# EAGLE design SparkX_smol_Dynamic_NFC_RFID_Tag (EAGLE 9.6.2)
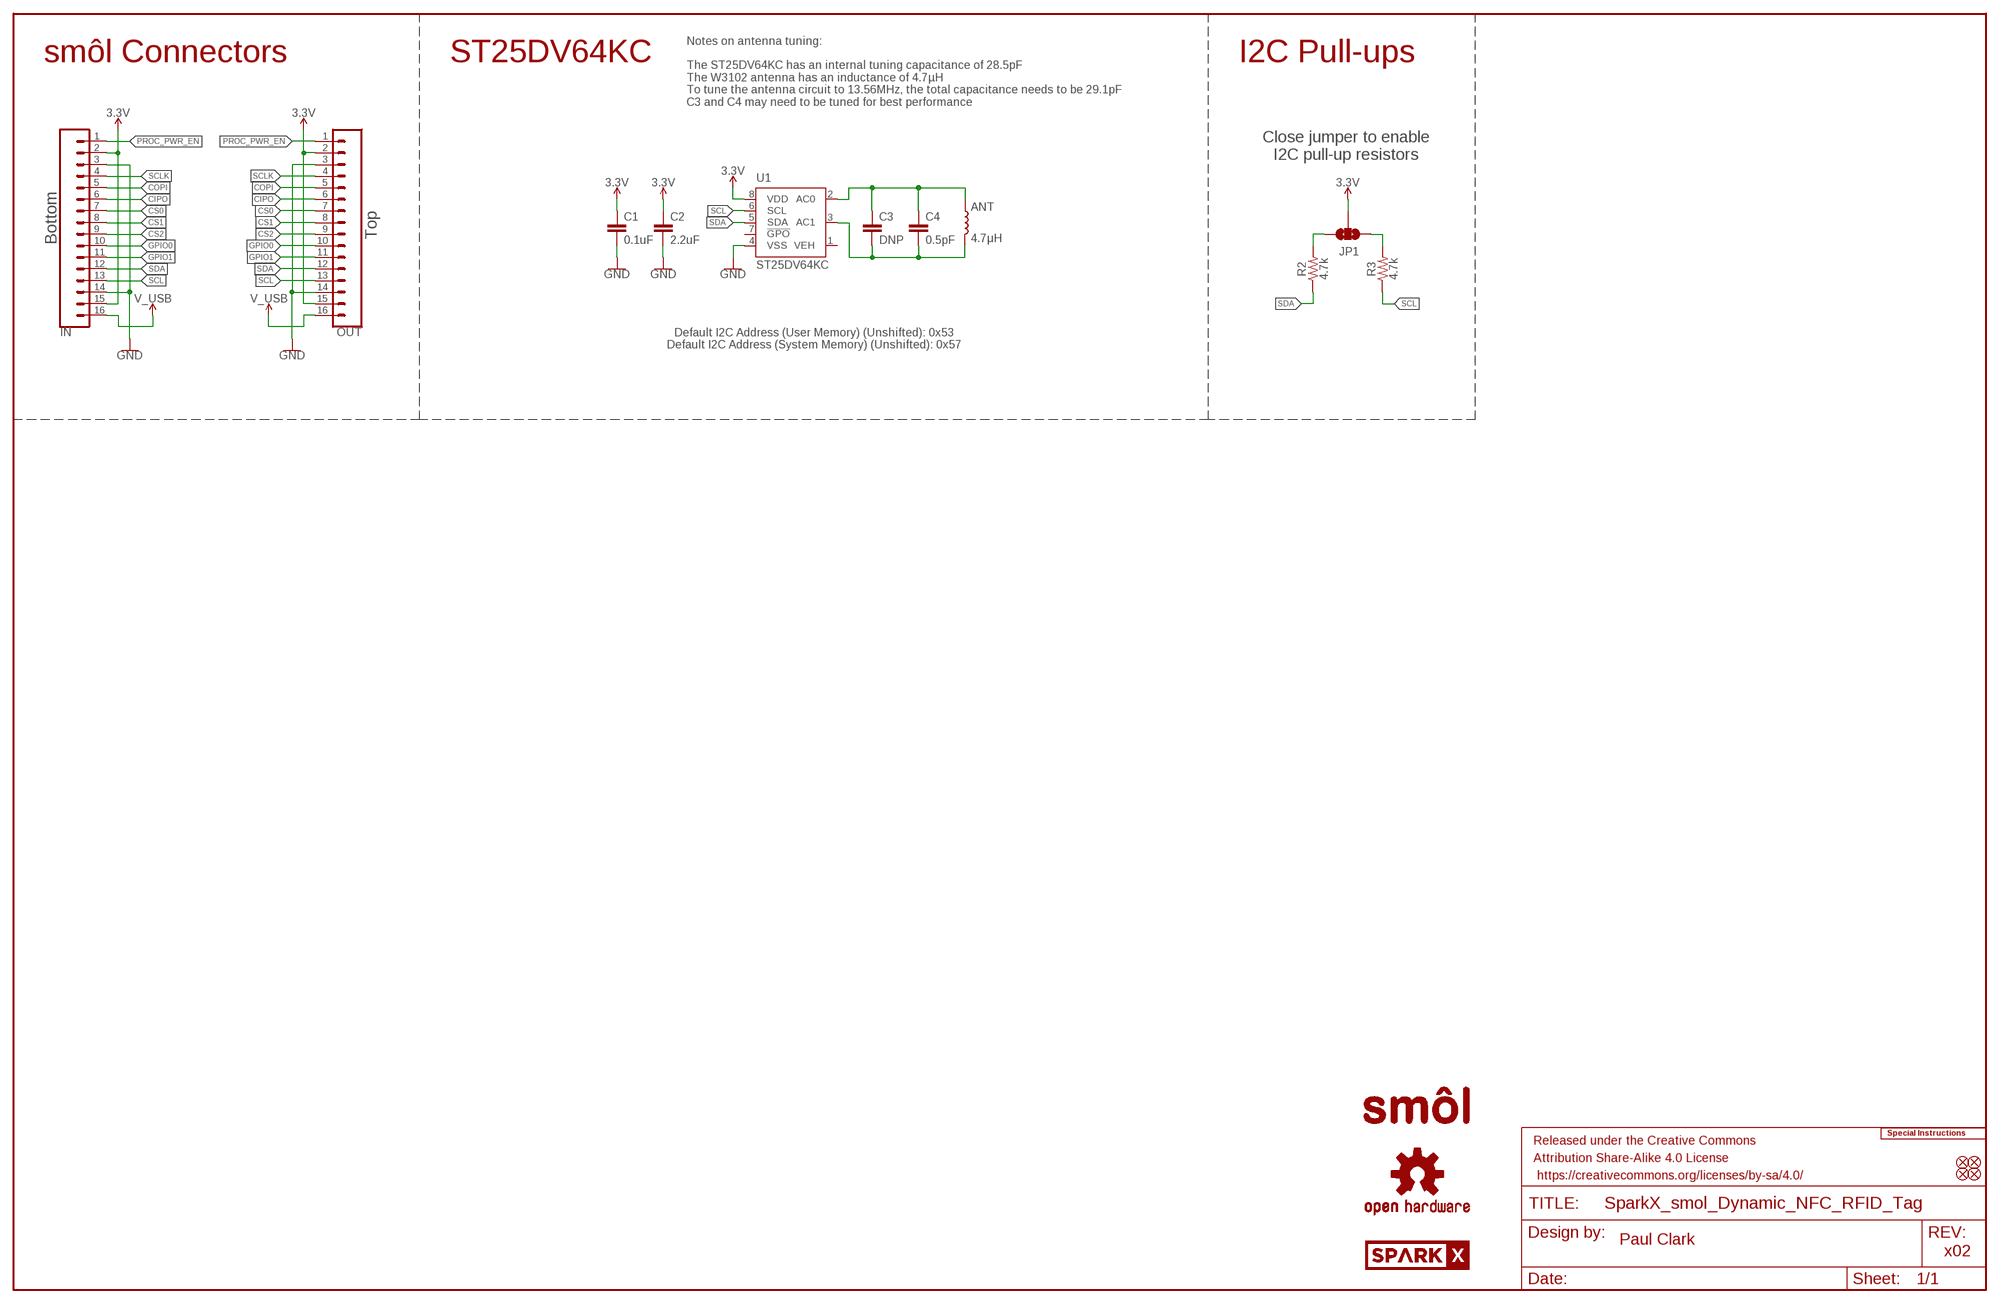
[diagram p0: schematic, sheet 1]

## Parts
ANT  4.7μH  RFID_ANTENNA_W3102  [W3102]
C1  0.1uF  0.1UF-0402T-6.3V-10%-X7R  [0402-TIGHT]
C2  2.2uF  2.2UF-0402_TIGHT-10V-10%-X5R  [0402-TIGHT]
C3  DNP  DNP-0402-TIGHT_NO_CREAM  [0402-TIGHT_NO_CREAM]
C4  0.5pF  0.5PF-0402_TIGHT-50V-PM0.05PF-NP0  [0402-TIGHT]
FD1  FIDUCIALUFIDUCIAL  [FIDUCIAL-MICRO]
FD2  FIDUCIALUFIDUCIAL  [FIDUCIAL-MICRO]
FD3  FIDUCIALUFIDUCIAL  [FIDUCIAL-MICRO]
FD4  FIDUCIALUFIDUCIAL  [FIDUCIAL-MICRO]
FRAME1  FRAME-LEDGER  [CREATIVE_COMMONS]
IN  CONN_16FPC_16_0.5MM  [FPC_16_0.5MM]
JP1  JUMPER-SMT_3_NO_SILK  [SMT-JUMPER_3_NO_SILK]
LOGO1  SPECIAL_INSTRUCTIONS-ORDERING  [ORDERING_INSTRUCTIONS]
LOGO2  OSHW-LOGOMINI  [OSHW-LOGO-MINI]
LOGO3  OSHW-LOGOMINI  [OSHW-LOGO-MINI]
OUT  CONN_16FPC_16_0.5MM  [FPC_16_0.5MM]
R2  4.7k  4.7KOHM-0402T-1/16W-1%  [0402-TIGHT]
R3  4.7k  4.7KOHM-0402T-1/16W-1%  [0402-TIGHT]
U1  ST25DV64KC  [SO08]
U$1  SPARKX-LOGO3  [SPARKX-SMALL]
U$3  SMOL_LOGOSMALL  [SMOL_SMALL]
U$9  SMOL_LOGOSMALL  [SMOL_SMALL]

## Nets
3.3V: C1.1 C2.1 IN.2 IN.15 JP1.2 OUT.2 OUT.15 U1.8(VDD)
CIPO: IN.6 OUT.6
COPI: IN.5 OUT.5
CS0: IN.7 OUT.7
CS1: IN.8 OUT.8
CS2: IN.9 OUT.9
GND: C1.2 C2.2 IN.3 IN.14 OUT.3 OUT.14 U1.4(VSS)
GPIO0: IN.10 OUT.10
GPIO1: IN.11 OUT.11
N$1: ANT.2 C3.2 C4.2 U1.3(AC1)
N$2: ANT.1 C3.1 C4.1 U1.2(AC0)
N$3: JP1.3 R2.2
N$4: JP1.1 R3.2
PROC_PWR_EN: IN.1 OUT.1
SCL: IN.13 OUT.13 R3.1 U1.6(SCL)
SCLK: IN.4 OUT.4
SDA: IN.12 OUT.12 R2.1 U1.5(SDA)
V_USB: IN.16 OUT.16
Unconnected: U1.7(!GPO!)

## Notes on the sheet
- Notes on antenna tuning:
  
  The ST25DV64KC has an internal tuning capacitance of 28.5pF
  The W3102 antenna has an inductance of 4.7µH
  To tune the antenna circuit to 13.56MHz, the total capacitance needs to be 29.1pF
  C3 and C4 may need to be tuned for best performance
- smôl Connectors | ST25DV64KC | I2C Pull-ups
- Close jumper to enable
  I2C pull-up resistors
- Top
- Bottom
- Default I2C Address (User Memory) (Unshifted): 0x53
  Default I2C Address (System Memory) (Unshifted): 0x57
- Paul Clark
- x02

## Power pins joined to a net without a drawn wire
VEH: U1.1(VEH)

## Library data of the parts
ANT = SparkFun-RF:RFID_ANTENNA_W3102: W3102 Pulse Larsen NFC / RFID SMD Antenna 13.56MHz 4.7μH; PROD_ID: ANT-16333
C1 = SparkFun-Capacitors:0.1UF: 0.1µF ceramic capacitors A capacitor is a passive two-terminal electrical component used to store electrical energy temporarily in an electric field.; PROD_ID: CAP-14993
C2 = SparkFun-Capacitors:2.2UF: 2.2µF ceramic capacitors A capacitor is a passive two-terminal electrical component used to store electrical energy temporarily in an electric field.; PROD_ID: CAP-14232
C3 = SparkFun-Capacitors:DNP: Do-Not-Populate capacitor
C4 = SparkFun-Capacitors:0.5PF: 0.5pF ceramic capacitors A capacitor is a passive two-terminal electrical component used to store electrical energy temporarily in an electric field.; PROD_ID: CAP-14362
FD1-FD4 = SparkFun-Aesthetics:FIDUCIAL: Fiducial Alignment Points Point-of-reference for pick-and-place machines and other optical instruments.
FRAME1 = SparkFun-Aesthetics:FRAME-LEDGER: Schematic Frame - Ledger Standard 11x14 US Ledger frame
IN OUT = SparkFun-Connectors:CONN_16: Multi connection point. Often used as Generic Header-pin footprint for 0.1 inch spaced/style header connections On any of the 0.1 inch spaced packages, you can populate with these: Break Away Headers - Straight <https://www.sparkfun.com/products/116> (PRT-00116) Break Away Male Headers - Right Angle <https://www.sparkfun.com/products/553> (PRT-00553) Female Headers <https://www.sparkfun.com/products/115> (PRT-00115) Break Away Headers - Machine Pin <https://www.sparkfun.com/products/117> (PRT-00117) Break Away Female Headers - Swiss Machine Pin <https://www.sparkfun.com/products/743> (PRT-00743) For SCREWTERMINALS and SPRING TERMINALS visit here: Screw Terimnals on SparkFun.com <https://www.sparkfun.com/search/results?term=Screw+Terminals> (5mm/3.5mm/2.54mm spacing) This device is also useful as a general connection point to wire up your design to another part of your project. Our various solder wires solder well into these plated through hole pads. Hook-Up Wire - Assortment (Stranded, 22 AWG) <https://www.sparkfun.com/products/11375> (PRT-11375) Hook-Up Wire - Assortment (Solid Core, 22 AWG) <https://www.sparkfun.com/products/11367> (PRT-11367) View the entire wire category on our website here <https://www.sparkfun.com/categories/141> Special notes: Molex polarized connector foot print use with SKU : PRT-08231 with associated crimp pins and housings. 1MM SMD Version SKU: PRT-10208 NOTES ON THE VARIANTS LOCK and LOCK_LONGPADS... This footprint was designed to help hold the alignment of a through-hole component (i.e. 6-pin header) while soldering it into place. You may notice that each hole has been shifted either up or down by 0.005 of an inch from it's more standard position (which is a perfectly straight line). This slight alteration caused the pins (the squares in the middle) to touch the edges of the holes. Because they are alternating, it causes a "brace" to hold the component in place. 0.005 has proven to be the perfect amount of "off-center" position when using our standard breakaway headers. Although looks a little odd when you look at the bare footprint, once you have a header in there, the alteration is very hard to notice. Also,if you push a header all the way into place, it is covered up entirely on the bottom side.; PROD_ID: CONN-16066
JP1 = SparkFun-Jumpers:JUMPER-SMT_3_NO: Normally open jumper This jumper has three pads in close proximity to each other. Apply solder to close the connection(s).
LOGO1 = SparkFun-Aesthetics:SPECIAL_INSTRUCTIONS: Special Ordering/Production Instructions Alert Symbol for special PCB ordering instructions or unique production process warnings. Ordering Instructions Production Instructions Types of information that should be added to box: Copper weight Soldermask color Silk color PCB thickness Number of layers PCB Standard: 1.6mm FR4 1 oz copper immersion silver plating red soldermask white silkscreen Types of information that should be added to box: Special wash requirements Depaneling instructions Humidification Glue curing Default text settings: 0.07 inch 9% ratio 50% line distance
LOGO2 LOGO3 = SparkFun-Aesthetics:OSHW-LOGO: Open-Source Hardware (OSHW) Logo This logo indicates the piece of hardware it is found on incorporates a OSHW license and/or adheres to the definition of open source hardware found here: http://freedomdefined.org/OSHW
R2 R3 = SparkFun-Resistors:4.7KOHM: 4.7kΩ resistor A resistor is a passive two-terminal electrical component that implements electrical resistance as a circuit element. Resistors act to reduce current flow, and, at the same time, act to lower voltage levels within circuits. - Wikipedia; PROD_ID: RES-15343
U1 = SparkFun-RF:ST25DV64KC: Dynamic NFC/RFID Dynamic NFC/RFID tag IC with 4-Kbit, 16-Kbit or 64-Kbit EEPROM, fast transfer mode capability and optimized I2C.; PROD_ID: IC-16315
U$1 = SparkX:SPARKX-LOGO
U$3 U$9 = SparkX:SMOL_LOGO

## Net classes
1 Power: width 0.305 mm
2 3.3V: width 0.508 mm

## Board
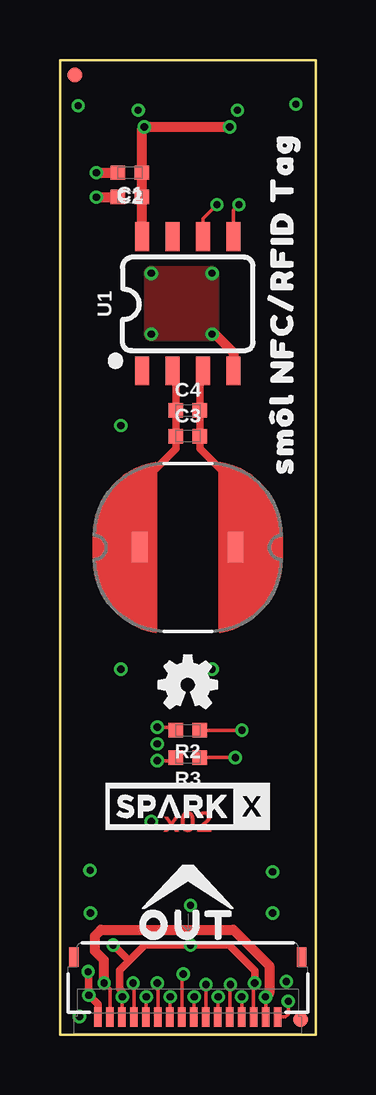
[diagram p1: board, top side]
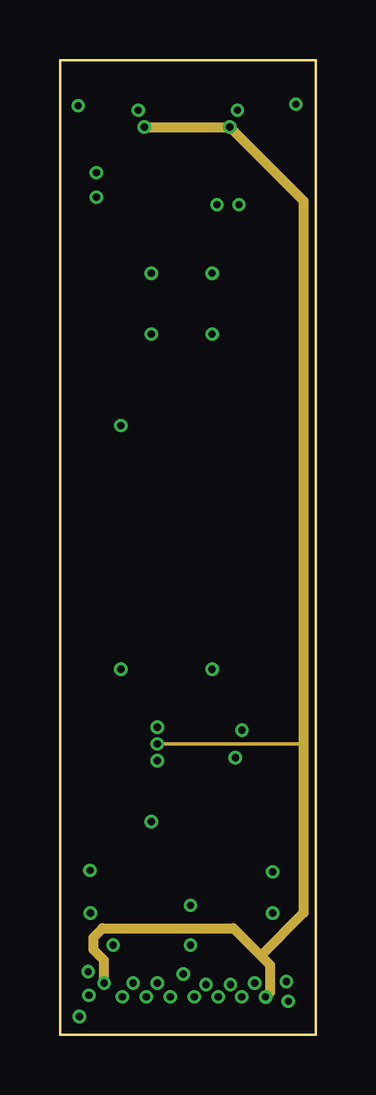
[diagram p2: board, inner layer Route2]
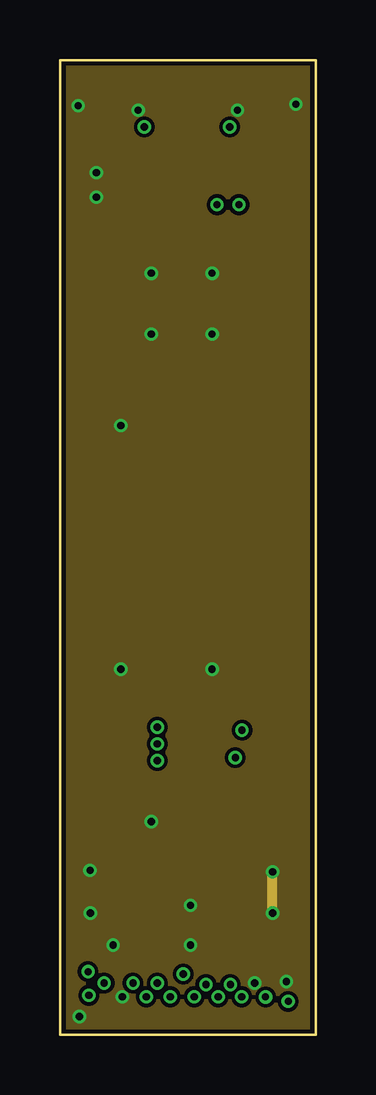
[diagram p3: board, inner layer Route15]
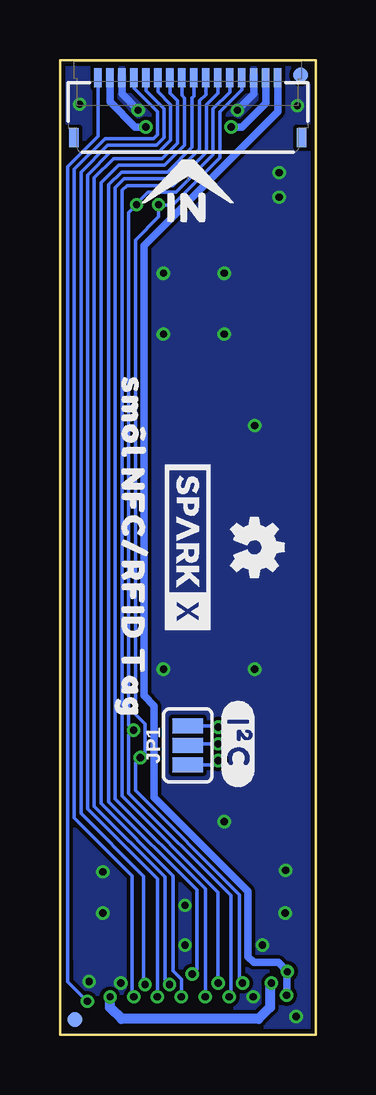
[diagram p4: board, bottom side, seen from below]

Size 10.67 x 40.64 mm. Coordinates in mm from the lower left corner, seen from the top.
Outline: 0,40.64 0,0 10.67,0 10.67,40.64 0,40.64
Copper layers (1+2*15+16): Top 0.035559375mm / dielectric 0.47751875mm / Route2 0.035559375mm / dielectric 0.47751875mm / Route15 0.035559375mm / dielectric 0.47751875mm / Bottom 0.035559375mm
Design rules "SparkFun-4-Layer-Minimum-JLCPCB *": minimum track width 5mil, minimum drill 0.2mm, track to track 5mil, track to pad 5mil, pad to pad 5mil, via to via 5mil, smd to smd 5mil, copper to edge 7mil, drill to drill 7mil, minimum pad ring 5mil, minimum via ring 5mil, stop-mask expansion 2.5mil, vias tented up to drill 25mil, thermal gap 10mil

### Footprints (pad centres in the part's own frame; a part is rotated, then mirrored left to right if it is on the bottom)
W3102 = smd 1.27 x 0.635: 1 0,2; 2 0,-2
0402-TIGHT = smd 0.6 x 0.6: 1 -0.5,0; 2 0.5,0
0402-TIGHT_NO_CREAM = smd 0.6 x 0.6: 1 -0.5,0; 2 0.5,0
FIDUCIAL-MICRO = smd 0.635 x 0.635: 1 0,0
FPC_16_0.5MM = smd 0.3 x 0.8: 1 -3.75,1.35; 2 -3.25,1.35; 3 -2.75,1.35; 4 -2.25,1.35; 5 -1.75,1.35; 6 -1.25,1.35; 7 -0.75,1.35; 8 -0.25,1.35; 9 0.25,1.35; 10 0.75,1.35; 11 1.25,1.35; 12 1.75,1.35; 13 2.25,1.35; 14 2.75,1.35; 15 3.25,1.35; 16 3.75,1.35 | smd 0.4 x 0.8: MP1 -4.75,-1.15; MP2 4.75,-1.15
SMT-JUMPER_3_NO_SILK = smd 0.635 x 1.27: 1 -0.813,0; 2 0,0; 3 0.813,0
SO08 = smd 0.6 x 1.2: 1 -1.905,-2.8; 2 -0.635,-2.8; 3 0.635,-2.8; 4 1.905,-2.8; 5 1.905,2.8; 6 0.635,2.8; 7 -0.635,2.8; 8 -1.905,2.8

### Placement (x,y rotation side)
ANT  5.33,20.32 90 top
C1  2.92,35.94 180 top
C2  2.92,34.92 180 top
C3  5.33,24.96 0 top
C4  5.33,26.04 0 top
FD1  0.64,40.01 0 top
FD2  0.64,40.01 0 bottom
FD3  10.03,0.64 0 top
FD4  10.03,0.64 0 bottom
FRAME1  45.72,-10.16 0 top  (outside the outline)
IN  5.33,38.54 0 bottom
JP1  5.33,12.06 90 bottom
LOGO1  19.05,50.8 0 top  (outside the outline)
LOGO2  5.33,14.61 0 top
LOGO3  2.54,20.32 270 bottom
OUT  5.33,2.1 180 top
R2  5.33,12.7 180 top
R3  5.33,11.56 180 top
U1  5.33,30.48 0 top
U$1  5.33,9.53 0 top
U$2  [SM�L_NFC#RFID_TAG0]  9.27,30.48 90 top
U$3  5.33,6.41 0 top
U$4  [SM�L_NFC#RFID_TAG0]  7.62,20.32 270 bottom
U$5  [#I�C#0]  3.24,12.13 270 bottom
U$8  [IN0]  5.33,34.48 0 bottom
U$9  5.33,35.81 0 bottom
U$17  [OUT0]  5.33,4.57 0 top
U$20  SPARKX-LOGO3  [SPARKX-SMALL]  5.33,20.32 270 bottom

### Tracks (layer width: path | path; a pad name or v marks a point on that pad's centre or on a via)
3.3V  (via drill 0.3)
  Top 0.152: OUT.2 v8.58,1.58 | OUT.15 2.08,1.92 v1.84,2.16
  Top 0.406: v8.58,1.58 8.73,1.73 8.73,2.88 7.24,4.38 1.71,4.38 1.46,4.13 1.46,3.49 1.84,3.11 v1.84,2.16 | v7.08,37.85 v3.52,37.85 3.42,37.75 C1.1 C2.1 U1.8
  Route2 0.152: v4.06,12.13 10.16,12.13
  Route2 0.406: v1.84,2.16 1.84,3.11 1.4,3.56 1.4,4.06 1.78,4.45 7.24,4.45 8.38,3.3 | v8.58,1.58 8.76,1.77 8.76,2.92 8.38,3.3 | v3.52,37.85 v7.08,37.85 10.16,34.77 10.16,12.13 10.16,5.08 8.38,3.3
  Bottom 0.152: v4.06,12.13 5.27,12.13 JP1.2
  Bottom 0.305: IN.15 2.08,38.84 3.08,37.85 v3.52,37.85 | v7.08,37.85 7.53,37.85 8.58,38.9 IN.2
  Bottom 0.406: v1.84,2.16 1.91,2.1 1.91,1.14 2.38,0.66 8.1,0.66 8.58,1.14 v8.58,1.58
CIPO  (via drill 0.3)
  Top 0.152: OUT.6 6.58,1.57 v6.6,1.59
  Bottom 0.152: IN.6 6.58,39.32 6.05,38.78 6.05,37.29 6.53,36.81 8.55,36.81 9.51,35.85 9.51,9.41 6.6,6.5 v6.6,1.59
COPI  (via drill 0.3)
  Top 0.152: OUT.5 7.08,2.07 v7.11,2.1
  Bottom 0.152: IN.5 7.08,39.36 6.33,38.6 6.33,37.4 6.64,37.09 8.67,37.09 9.79,35.96 9.79,9.23 7.18,6.62 7.18,2.16 v7.11,2.1
CS0  (via drill 0.3)
  Top 0.152: OUT.7 6.08,2.08 v6.1,2.1
  Bottom 0.152: IN.7 6.08,39.26 5.77,38.94 5.77,37.17 6.41,36.53 8.44,36.53 9.23,35.73 9.23,9.53 6.29,6.58 6.29,2.29 v6.1,2.1
CS1  (via drill 0.3)
  Top 0.152: OUT.8 5.58,1.57 v5.6,1.59
  Bottom 0.152: IN.8 5.58,39.16 5.46,39.04 5.46,37.09 6.3,36.25 8.22,36.25 8.95,35.52 8.95,9.64 5.94,6.63 5.94,2.66 5.6,2.32 v5.6,1.59
CS2  (via drill 0.3)
  Top 0.152: OUT.9 5.08,2.48 v5.14,2.54
  Bottom 0.152: IN.9 5.08,39.13 5.15,39.07 5.15,37 6.18,35.97 8.11,35.97 8.64,35.44 8.64,9.72 4.95,6.04 4.95,2.73 v5.14,2.54
GND  (via drill 0.3)
  Top 0.152: v8.13,2.16 8.06,2.1 8.06,0.77 OUT.3 | OUT.14 2.58,1.57 v2.6,1.59
  Top 0.305: v2.6,1.59 2.6,1.82 2.49,1.93 2.49,2.68 2.89,3.08 | v8.13,2.16 8.13,2.67 7.05,3.75 3.56,3.75 2.89,3.08 | v2.22,3.75 2.89,3.08
  Top 0.406: v1.52,35.94 C1.2 | v1.52,34.92 C2.2 | v6.35,29.21 6.48,29.21 7.24,28.45 U1.4
  Route15 0.406: v8.88,5.08 v8.88,6.79
  Bottom 0.305: IN.14 2.58,39.23 v3.27,38.54 | IN.3 8.08,39.23 v7.4,38.54
  other vias: 1.27,5.08 9.84,38.8 0.76,38.73 9.45,2.22 6.35,31.75 3.81,29.21 3.81,31.75 2.54,15.24 6.35,15.24 3.81,8.89 2.54,25.4 1.25,6.86 0.81,0.76 5.45,3.75 5.45,5.4
  pour Bottom (isolate 0.152, rank 2): 0,40.64 10.67,40.64 10.67,0 0,0
  pour Route15 (isolate 0.152, rank 2): 0,40.64 10.67,40.64 10.67,0 0,0
  pour Top: 3.81,31.75 3.81,29.21 6.35,29.21 6.35,31.75
GPIO0  (via drill 0.3)
  Top 0.152: OUT.10 4.58,1.57 v4.6,1.59
  Bottom 0.152: IN.10 4.58,39.2 4.84,38.94 4.84,36.92 6.07,35.69 7.99,35.69 8.36,35.32 8.36,9.84 4.6,6.09 v4.6,1.59
GPIO1  (via drill 0.3)
  Top 0.152: OUT.11 4.08,2.14 v4.06,2.16
  Bottom 0.152: IN.11 4.08,39.26 4.56,38.78 4.56,36.8 5.95,35.41 7.87,35.41 8.08,35.21 8.08,9.95 4.06,5.94 v4.06,2.16
N$1
  Top 0.305: ANT.2 7.33,22.95 5.83,24.45 C3.2 C4.2 5.83,27.55 U1.3
N$2
  Top 0.305: U1.2 4.83,27.55 C4.1 C3.1 4.83,24.45 3.33,22.95 ANT.1
N$3  (via drill 0.3)
  Top 0.152: R2.2 4.71,12.83 v4.06,12.83
  Bottom 0.152: v4.06,12.83 4.12,12.88 JP1.3
N$4  (via drill 0.3)
  Top 0.152: R3.2 4.71,11.43 v4.06,11.43
  Bottom 0.152: v4.06,11.43 4.24,11.25 JP1.1
PROC_PWR_EN  (via drill 0.3)
  Top 0.152: v9.53,1.4 9.53,0.87 9.4,0.75 OUT.1
  Bottom 0.152: v9.53,1.4 10.35,2.22 10.35,3.11 10.35,36.2 9.08,37.46 IN.1
SCL  (via drill 0.3)
  Top 0.152: OUT.13 3.08,2.12 v3.05,2.16 | U1.6 5.97,34.02 v6.56,34.61 | v7.32,11.56 R3.1
  Bottom 0.152: IN.13 3.08,39.41 4,38.49 4,36.57 5.97,34.6 6.54,34.6 v6.56,34.61 6.56,34.1 7.52,33.14 7.52,13.36 7.11,12.95 7.11,11.76 v7.32,11.56 7.52,11.36 7.52,10.19 3.17,5.84 3.17,2.29 v3.05,2.16
SCLK  (via drill 0.3)
  Top 0.152: OUT.4 v7.58,1.59 | v7.58,1.59
  Bottom 0.152: IN.4 7.58,39.47 6.61,38.49 6.61,37.52 6.76,37.37 8.79,37.37 10.07,36.08 10.07,9.05 7.65,6.63 7.65,1.65 v7.58,1.59
SDA  (via drill 0.3)
  Top 0.152: OUT.12 3.58,1.57 v3.6,1.59 | U1.5 7.24,34.38 v7.47,34.61 | v7.6,12.7 R2.1
  Bottom 0.152: IN.12 3.58,39.3 4.28,38.6 4.28,36.69 5.83,35.13 7,35.13 7.47,34.66 v7.47,34.61 7.8,34.28 7.8,12.9 v7.6,12.7 7.8,12.5 7.8,10.07 3.54,5.81 3.54,1.65 v3.6,1.59
V_USB  (via drill 0.3)
  Top 0.305: OUT.16 1.58,1.27 v1.21,1.65 1.21,2.6 v1.18,2.63
  Bottom 0.305: v1.21,1.65 1.21,2.6 v1.18,2.63 1.56,3.02 2.57,3.02 2.82,3.26 2.82,5.99 6.73,9.9 6.73,13.71 7.16,14.14 7.16,32.9 1.58,38.48 IN.16

### Text on the board
Top: x02
Measures: Dimensions in Inches
tDocu: 4-Layer Board / 0.8mm Thickness / 1oz Copper (Outer layers) / HASL Finish | Paul Clark